# Altium schematic sheet ESP8266-12-E.SchDoc: TITLE
size A4; Address1: ludzinc.blogspot.com.au; Address3: www.lowcostlabs.com.au; DocumentNumber: LCL_004; Revision: V2.00; SheetNumber: 4; SheetTotal: 8
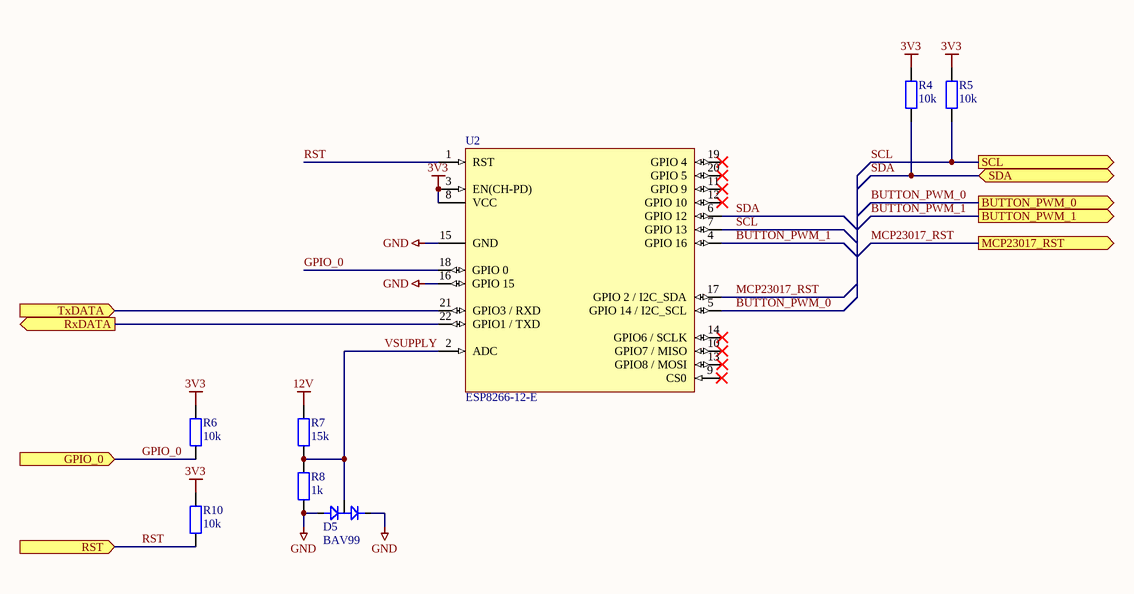
[diagram p0: ESP8266-12-E.SchDoc]

## Parts
D5  BAV99  [ONSC-SOT-23-3-318-08_V]
R4  10k  [PCB-3652081-2]
R5  10k  [PCB-3652081-2]
R6  10k  [PCB-3652081-2]
R7  15k  [PCB-3652081-2]
R8  1k  [PCB-3652081-2]
R10  10k  [PCB-3652081-2]
U2  ESP8266-12-E  [ESP-12E]

## Ports
BUTTON_PWM_0 (out), BUTTON_PWM_1 (out), GPIO_0 (in), MCP23017_RST (out), RST (in), RxDATA (out), SCL (out), SDA (bidir), TxDATA (in)

## Nets
3V3: R4.1 R5.2 R6.2 R10.2 U2.3(EN(CH-PD)) U2.8(VCC)
12V: R7.2
GND: D5.1(A) D5.2(K) R8.1 U2.15(GND) U2.16(GPIO_15)
BUTTON_PWM_0: U2.5(GPIO_14_/_I2C_SCL) ; port BUTTON_PWM_0
BUTTON_PWM_1: U2.4(GPIO_16) ; port BUTTON_PWM_1
GPIO_0: R6.1 U2.18(GPIO_0) ; port GPIO_0
MCP23017_RST: U2.17(GPIO_2_/_I2C_SDA) ; port MCP23017_RST
RST: R10.1 U2.1(RST) ; port RST
RxDATA: U2.22(GPIO1_/_TXD) ; port RxDATA
SCL: R5.1 U2.7(GPIO_13) ; port SCL
SDA: R4.2 U2.6(GPIO_12) ; port SDA
TxDATA: U2.21(GPIO3_/_RXD) ; port TxDATA
VSUPPLY: D5.3(K/A) R7.1 R8.2 U2.2(ADC)

Not connected (* = marked no-connect by the designer): U2 9(CS0)* 10(GPIO7_/_MISO)* 11(GPIO_9)* 12(GPIO_10)* 13(GPIO8_/_MOSI)* 14(GPIO6_/_SCLK)* 19(GPIO_4)* 20(GPIO_5)*

## Notes on the sheet
- LOW COST LABS
- Title
- Size:
- Date:
- A4
- Number:
- Revision:
- Sheet
- of
- File:

## Library data of the parts
D5 = CMP-10548246-4: Dual Series Switching Diodes, 3-Pin SOT-23, Pb-Free, Tape and Reel; Voltage Rating (DC): 70.0 V; Current Rating: 0.2 A; Lead-Free Status: Lead Free; Forward Voltage: 1.0 V; Capacitance: 1.5e-12 F; Case/Package: SOT-23; REACH SVHC Compliance: No SVHC; RoHS: Compliant; Octopart Url: https://octopart.com/bav99lt1g-on+semiconductor-55396102; Number of Pins: 3; Halogen Free Status: Halogen Free; Lifecycle Status: Active; Mounting Style: Surface Mount; OctopartID: b3e779a0d1876c20
R4-R8 R10 = CMP-rprrpiwz7au7w5x5ojb2-2: GENERIC 0805 RESISTOR; CustomComponentID: rprrpiwz7au7w5x5ojb2
U2 = CMP-2c9ce6e9266cf35b-4: ESP8266-12-E Wifi Module; Manufacturer Part Number: 2491; Octopart URL: http://octopart.com/2491-adafruit+industries-65271392; RoHS: Compliant; OctopartID: f2f4381d21f22d33; Material: PCB Module; Color: Black